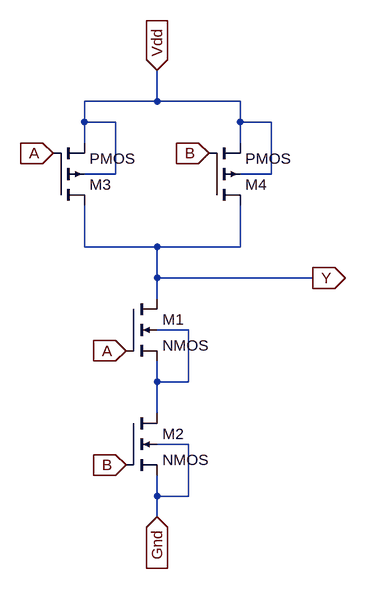
[diagram p0: schematic nand.asc]
nand.asc, the LTspice schematic file:
Version 4
SHEET 1 880 680
WIRE 192 -176 192 -224
WIRE 192 -176 80 -176
WIRE 320 -176 192 -176
WIRE 80 -144 80 -176
WIRE 128 -144 80 -144
WIRE 320 -144 320 -176
WIRE 368 -144 320 -144
WIRE 80 -112 80 -144
WIRE 320 -112 320 -144
WIRE 128 -64 128 -144
WIRE 128 -64 80 -64
WIRE 368 -64 368 -144
WIRE 368 -64 320 -64
WIRE 80 48 80 -16
WIRE 192 48 80 48
WIRE 320 48 320 -16
WIRE 320 48 192 48
WIRE 192 96 192 48
WIRE 432 96 192 96
WIRE 192 128 192 96
WIRE 240 176 192 176
WIRE 192 256 192 224
WIRE 240 256 240 176
WIRE 240 256 192 256
WIRE 192 304 192 256
WIRE 240 352 192 352
WIRE 192 432 192 400
WIRE 240 432 240 352
WIRE 240 432 192 432
WIRE 192 464 192 432
FLAG 192 464 Gnd
IOPIN 192 464 In
FLAG 144 384 B
IOPIN 144 384 In
FLAG 144 208 A
IOPIN 144 208 In
FLAG 32 -96 A
IOPIN 32 -96 In
FLAG 272 -96 B
IOPIN 272 -96 In
FLAG 432 96 Y
IOPIN 432 96 Out
FLAG 192 -224 Vdd
IOPIN 192 -224 In
SYMBOL nmos4 144 128 R0
SYMATTR InstName M1
SYMBOL nmos4 144 304 R0
SYMATTR InstName M2
SYMBOL pmos4 32 -16 M180
SYMATTR InstName M3
SYMBOL pmos4 272 -16 M180
SYMATTR InstName M4

The netlist it stands for:
* nand.asc
M1 Y A N001 N001 NMOS
M2 N001 B Gnd Gnd NMOS
M3 Y A Vdd Vdd PMOS
M4 Y B Vdd Vdd PMOS
.model NMOS NMOS
.model PMOS PMOS
.lib standard.mos
.backanno
.end